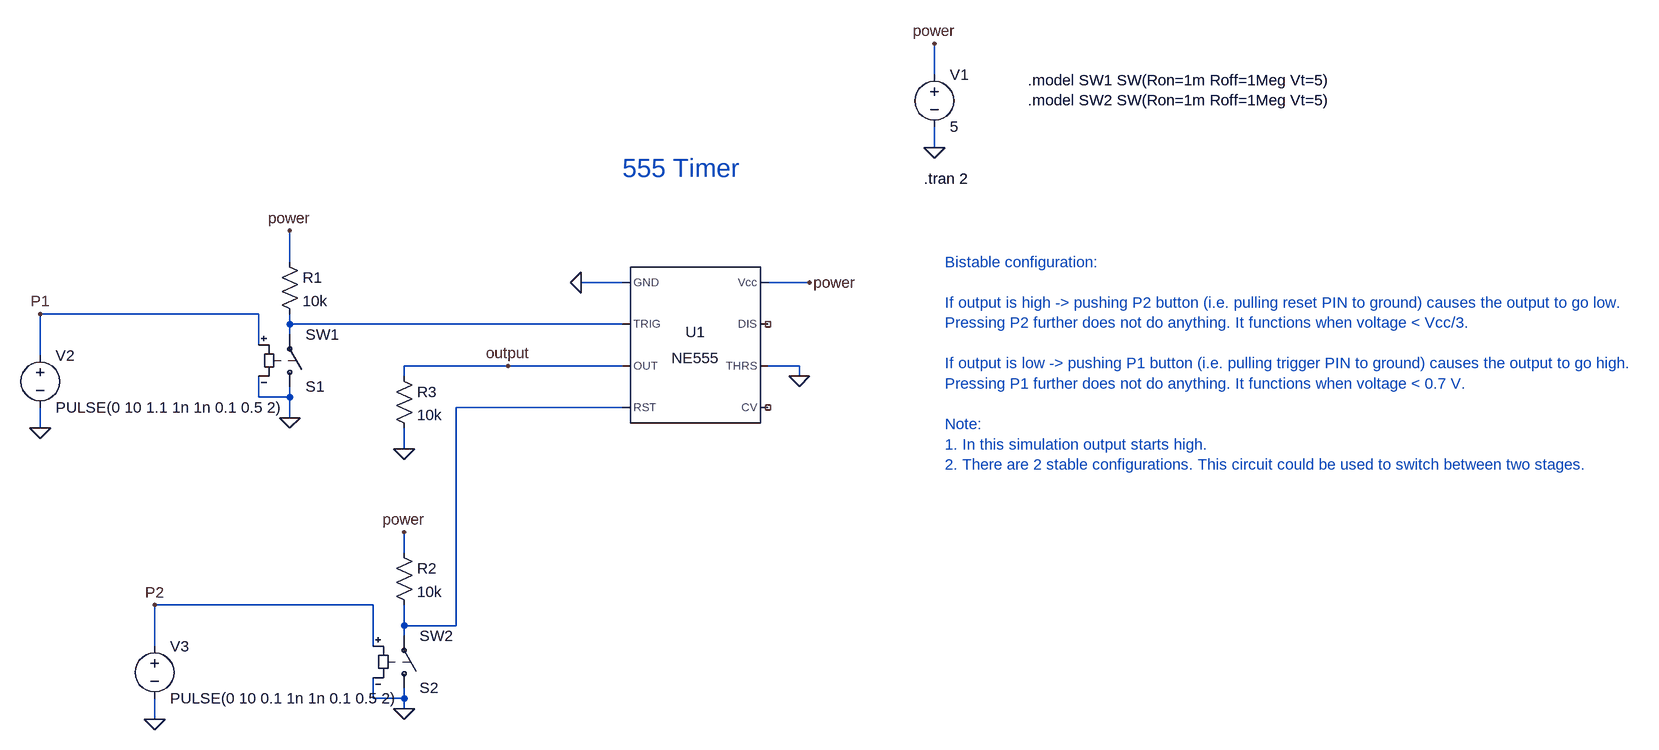
[diagram p0: schematic 555-bistable-mode.asc]
555-bistable-mode.asc, the LTspice schematic file:
Version 4.1
SHEET 1 2012 836
WIRE 864 -176 864 -224
WIRE 864 -64 864 -96
WIRE -128 112 -128 64
WIRE 384 144 320 144
WIRE 672 144 608 144
WIRE -176 192 -512 192
WIRE -128 208 -128 192
WIRE 384 208 -128 208
WIRE -128 224 -128 208
WIRE -176 240 -176 192
WIRE -512 256 -512 192
WIRE 208 272 48 272
WIRE 384 272 208 272
WIRE 656 272 608 272
WIRE 48 288 48 272
WIRE 656 288 656 272
WIRE -176 320 -176 288
WIRE -128 320 -128 304
WIRE -128 320 -176 320
WIRE 384 336 128 336
WIRE -128 352 -128 320
WIRE -512 368 -512 336
WIRE 48 400 48 368
WIRE 48 560 48 528
WIRE 0 640 -336 640
WIRE 48 672 48 640
WIRE 128 672 128 336
WIRE 128 672 48 672
WIRE 48 688 48 672
WIRE -336 704 -336 640
WIRE 0 704 0 640
WIRE 0 784 0 752
WIRE 48 784 48 768
WIRE 48 784 0 784
WIRE 48 800 48 784
WIRE -336 816 -336 784
FLAG -128 352 0
FLAG 864 -64 0
FLAG 864 -224 power
FLAG 672 144 power
FLAG -128 64 power
FLAG 320 144 0
FLAG -512 368 0
FLAG 48 800 0
FLAG 48 528 power
FLAG -336 816 0
FLAG 656 288 0
FLAG 48 400 0
FLAG 208 272 output
FLAG -512 192 P1
FLAG -336 640 P2
SYMBOL Misc\\NE555 496 240 R0
SYMATTR InstName U1
SYMBOL res -144 96 R0
SYMATTR InstName R1
SYMATTR Value 10k
SYMBOL voltage 864 -192 R0
WINDOW 123 0 0 Left 2
WINDOW 39 0 0 Left 2
SYMATTR InstName V1
SYMATTR Value 5
SYMBOL sw -128 320 M180
SYMATTR InstName S1
SYMATTR Value SW1
SYMBOL voltage -512 240 R0
WINDOW 123 0 0 Left 0
WINDOW 39 0 0 Left 0
SYMATTR InstName V2
SYMATTR Value PULSE(0 10 1.1 1n 1n 0.1 0.5 2)
SYMBOL res 32 544 R0
SYMATTR InstName R2
SYMATTR Value 10k
SYMBOL sw 48 784 M180
SYMATTR InstName S2
SYMATTR Value SW2
SYMBOL voltage -336 688 R0
WINDOW 123 0 0 Left 0
WINDOW 39 0 0 Left 0
SYMATTR InstName V3
SYMATTR Value PULSE(0 10 0.1 1n 1n 0.1 0.5 2)
SYMBOL res 32 272 R0
SYMATTR InstName R3
SYMATTR Value 10k
TEXT 848 -16 Left 2 !.tran 2
TEXT 384 -32 Left 4 ;555 Timer
TEXT 1008 -168 Left 2 !.model SW1 SW(Ron=1m Roff=1Meg Vt=5)\n.model SW2 SW(Ron=1m Roff=1Meg Vt=5)
TEXT 880 112 Left 2 ;Bistable configuration:\n \nIf output is high -> pushing P2 button (i.e. pulling reset PIN to ground) causes the output to go low.\nPressing P2 further does not do anything. It functions when voltage < Vcc/3.\n \nIf output is low -> pushing P1 button (i.e. pulling trigger PIN to ground) causes the output to go high.\nPressing P1 further does not do anything. It functions when voltage < 0.7 V.\n \nNote:\n1. In this simulation output starts high.\n2. There are 2 stable configurations. This circuit could be used to switch between two stages.

The netlist it stands for:
* 555-bistable-mode.asc
X§U1 0 N001 output N002 NC_01 0 NC_02 power NE555  ; pins GND TRIG OUT RST CV THRS DIS Vcc
R1 power N001 10k
V1 power 0 5
S1 0 N001 P1 0 SW1
V2 P1 0 PULSE(0 10 1.1 1n 1n 0.1 0.5 2)
R2 power N002 10k
S2 0 N002 P2 0 SW2
V3 P2 0 PULSE(0 10 0.1 1n 1n 0.1 0.5 2)
R3 output 0 10k
.tran 2
* 555 Timer
.model SW1 SW(Ron=1m Roff=1Meg Vt=5)
.model SW2 SW(Ron=1m Roff=1Meg Vt=5)
* Bistable configuration:
* If output is high -> pushing P2 button (i.e. pulling reset PIN to ground) causes the output to go low.
* Pressing P2 further does not do anything. It functions when voltage < Vcc/3.
* If output is low -> pushing P1 button (i.e. pulling trigger PIN to ground) causes the output to go high.
* Pressing P1 further does not do anything. It functions when voltage < 0.7 V.
* Note:
* 1. In this simulation output starts high.
* 2. There are 2 stable configurations. This circuit could be used to switch between two stages.
.lib NE555.sub
.backanno
.end